# Altium schematic sheet FAN.SchDoc
size B
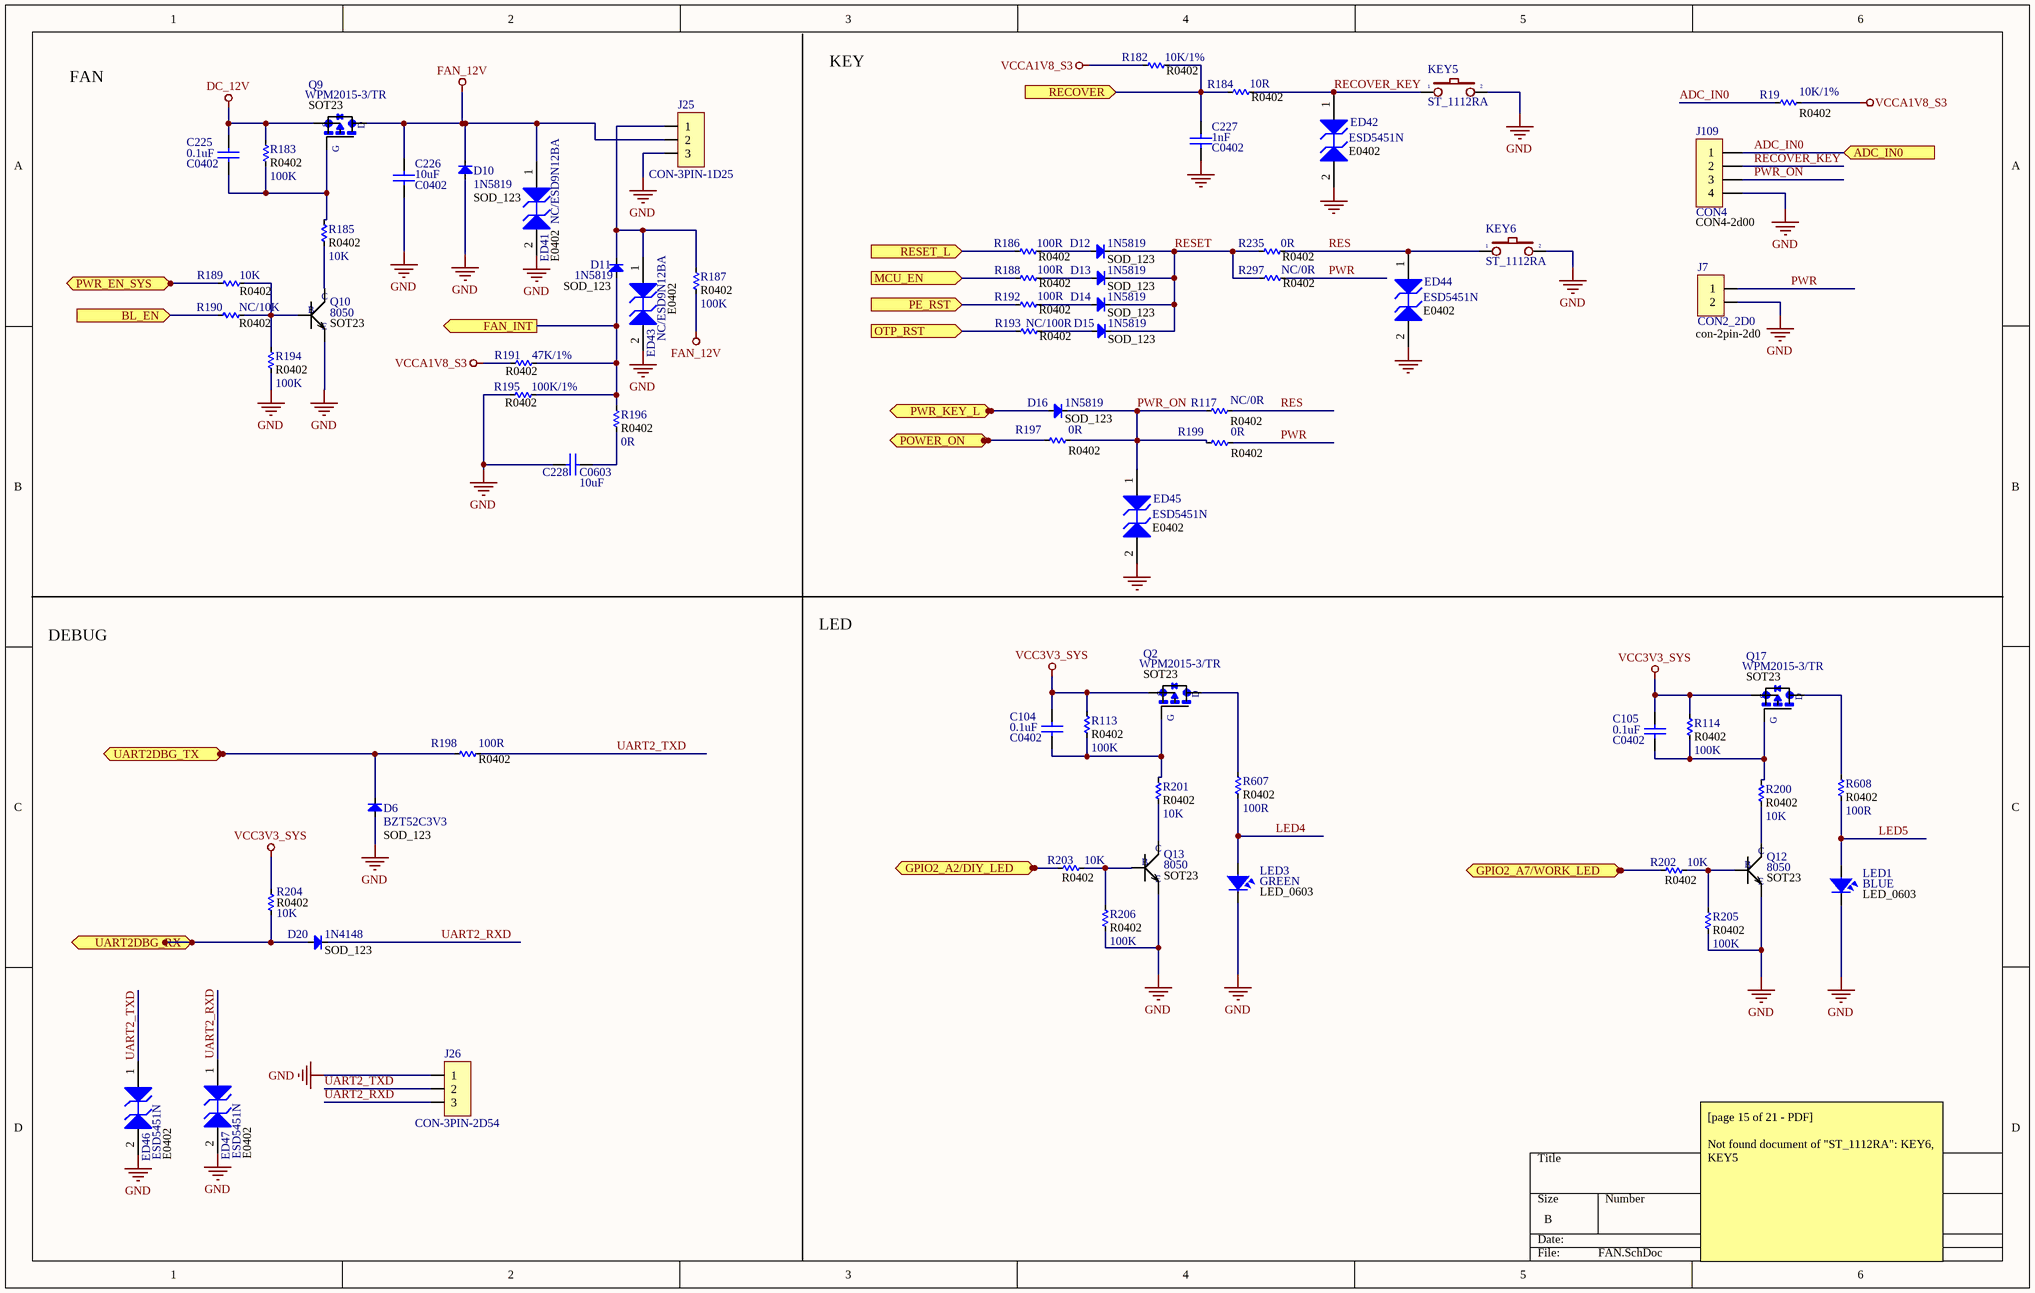
[diagram p0: FAN.SchDoc]

## Parts
C104  C0402  value 0.1uF  [C 0402]
C105  C0402  value 0.1uF  [C 0402]
C225  C0402  value 0.1uF  [C 0402]
C226  C0402  value 10uF  [C 0402]
C227  C0402  value 1nF  [C 0402]
C228  C0603  value 10uF  [C 0603]
D6  BZT52C3V3  typr: SOD_123  [DIO-SMD-123]
D10  value 1N5819  typr: SOD_123  [DIO-SMD-123]  (hidden comment: Diode SMD)
D11  value 1N5819  typr: SOD_123  [DIO-SMD-123]  (hidden comment: Diode SMD)
D12  value 1N5819  typr: SOD_123  [DIO-SMD-123]  (hidden comment: Diode SMD)
D13  value 1N5819  typr: SOD_123  [DIO-SMD-123]  (hidden comment: Diode SMD)
D14  value 1N5819  typr: SOD_123  [DIO-SMD-123]  (hidden comment: Diode SMD)
D15  value 1N5819  typr: SOD_123  [DIO-SMD-123]  (hidden comment: Diode SMD)
D16  value 1N5819  typr: SOD_123  [DIO-SMD-123]  (hidden comment: Diode SMD)
D20  value 1N4148  typr: SOD_123  [DIO-SMD-123]  (hidden comment: Diode SMD)
ED41  NC/ESD9N12BA  [DFN1006-2L]
ED42  ESD5451N  [DFN1006-2L]
ED43  NC/ESD9N12BA  [DFN1006-2L]
ED44  ESD5451N  [DFN1006-2L]
ED45  ESD5451N  [DFN1006-2L]
ED46  ESD5451N  [DFN1006-2L]
ED47  ESD5451N  [DFN1006-2L]
J7  CON2_2D0  [CON2]
J25  CON-3PIN-1D25  [CON3]
J26  CON-3PIN-2D54  [CON3]
J109  CON4  [CON4]
KEY5  ST_1112RA  [SW1-SMD]
KEY6  ST_1112RA  [SW1-SMD]
LED1  Package: LED_0603  Color: BLUE  [SM-LED-0805-Blue]  (hidden comment: LED SMD)
LED3  Package: LED_0603  Color: GREEN  [SM-LED-0805-Green]  (hidden comment: LED SMD)
Q2  WPM2015-3/TR  [*SSOT-3]
Q9  WPM2015-3/TR  [*SSOT-3]
Q10  8050  [*SOT-23]
Q12  8050  [*SOT-23]
Q13  8050  [*SOT-23]
Q17  WPM2015-3/TR  [*SSOT-3]
R19  R0402  value 10K/1%  [R 0402]
R113  R0402  value 100K  [R 0402]
R114  R0402  value 100K  [R 0402]
R117  R0402  value NC/0R  [R 0402]
R182  R0402  value 10K/1%  [R 0402]
R183  R0402  value 100K  [R 0402]
R184  R0402  value 10R  [R 0402]
R185  R0402  value 10K  [R 0402]
R186  R0402  value 100R  [R 0402]
R187  R0402  value 100K  [R 0402]
R188  R0402  value 100R  [R 0402]
R189  R0402  value 10K  [R 0402]
R190  R0402  value NC/10K  [R 0402]
R191  R0402  value 47K/1%  [R 0402]
R192  R0402  value 100R  [R 0402]
R193  R0402  value NC/100R  [R 0402]
R194  R0402  value 100K  [R 0402]
R195  R0402  value 100K/1%  [R 0402]
R196  R0402  value 0R  [R 0402]
R197  R0402  value 0R  [R 0402]
R198  R0402  value 100R  [R 0402]
R199  R0402  value 0R  [R 0402]
R200  R0402  value 10K  [R 0402]
R201  R0402  value 10K  [R 0402]
R202  R0402  value 10K  [R 0402]
R203  R0402  value 10K  [R 0402]
R204  R0402  value 10K  [R 0402]
R205  R0402  value 100K  [R 0402]
R206  R0402  value 100K  [R 0402]
R235  R0402  value 0R  [R 0402]
R297  R0402  value NC/0R  [R 0402]
R607  R0402  value 100R  [R 0402]
R608  R0402  value 100R  [R 0402]

## Ports
ADC_IN0 (in), BL_EN (in), FAN_INT (out), GPIO2_A2/DIY_LED (in), GPIO2_A7/WORK_LED (in), MCU_EN (in), OTP_RST (in), PE_RST (in), POWER_ON (in), PWR_EN_SYS (in), PWR_KEY_L (in), RECOVER (in), RESET_L (in), UART2DBG_RX (out), UART2DBG_TX (in)

## Nets
DC_12V: C225.1 Q9.2(S) R183.2
FAN_12V: C226.1 D10.2(K) ED41.1(A1) J25.2 Q9.3(D) R187.1
GND: C226.2 C227.2 C228.1 D6.1(A) D10.1(A) ED41.2(A2) ED42.2(A2) ED43.2(A2) ED44.2(A2) ED45.2(A2) ED46.2(A2) ED47.2(A2) J7.2 J25.3 J26.1 J109.4 KEY5.2 KEY6.2 LED1.2 LED3.2 Q10.2(E) Q12.2(E) Q13.2(E) R194.2 R195.2 R205.2 R206.2
VCC3V3_SYS: C104.1 C105.1 Q2.2(S) Q17.2(S) R113.1 R114.1 R204.1
VCCA1V8_S3: R19.2 R182.1 R191.2
ADC_IN0: J109.1 R19.1 ; port ADC_IN0
BL_EN: R190.2 ; port BL_EN
FAN_INT: D11.1(A) R191.1 R195.1 R196.1 ; port FAN_INT
GPIO2_A2/DIY_LED: R203.1 ; port GPIO2_A2/DIY_LED
GPIO2_A7/WORK_LED: R202.1 ; port GPIO2_A7/WORK_LED
LED4: LED3.1 R607.2
LED5: LED1.1 R608.2
MCU_EN: R188.1 ; port MCU_EN
OTP_RST: R193.1 ; port OTP_RST
PE_RST: R192.1 ; port PE_RST
POWER_ON: R197.1 ; port POWER_ON
PWR: J7.1 R199.2 R297.2
PWR_EN_SYS: R189.2 ; port PWR_EN_SYS
PWR_KEY_L: D16.1(A) ; port PWR_KEY_L
PWR_ON: D16.2(K) ED45.1(A1) J109.3 R117.1 R197.2 R199.1
RECOVER: C227.1 R182.2 R184.1 ; port RECOVER
RECOVER_KEY: ED42.1(A1) J109.2 KEY5.1 R184.2
RES: ED44.1(A1) KEY6.1 R117.2 R235.2
RESET: D12.2(K) D13.2(K) D14.2(K) D15.2(K) R235.1 R297.1
RESET_L: R186.1 ; port RESET_L
UART2_RXD: D20.2(K) ED47.1(A1) J26.3
UART2_TXD: ED46.1(A1) J26.2 R198.2
UART2DBG_RX: D20.1(A) R204.2 ; port UART2DBG_RX
UART2DBG_TX: D6.2(K) R198.1 ; port UART2DBG_TX
NetC104_2: C104.2 Q2.1(G) R113.2 R201.1
NetC105_2: C105.2 Q17.1(G) R114.2 R200.1
NetC225_2: C225.2 Q9.1(G) R183.1 R185.2
NetC228_2: C228.2 R196.2
NetD11_2: D11.2(K) ED43.1(A1) J25.1 R187.2
NetD12_1: D12.1(A) R186.2
NetD13_1: D13.1(A) R188.2
NetD14_1: D14.1(A) R192.2
NetD15_1: D15.1(A) R193.2
NetQ2_3: Q2.3(D) R607.1
NetQ10_1: Q10.1(B) R189.1 R190.1 R194.1
NetQ10_3: Q10.3(C) R185.1
NetQ12_1: Q12.1(B) R202.2 R205.1
NetQ12_3: Q12.3(C) R200.2
NetQ13_1: Q13.1(B) R203.2 R206.1
NetQ13_3: Q13.3(C) R201.2
NetQ17_3: Q17.3(D) R608.1

## Notes on the sheet
- FAN
- KEY
- LED
- DEBUG
- [page 15 of 21 - PDF]
  Not found document of "ST_1112RA": KEY6, KEY5
- (in symbol 1SMB54CAT3) E0402
- (in symbol FDN304P) SOT23
- (in symbol JP2) con-2pin-2d0
- (in symbol JP4x1-2.0) CON4-2d00
- (in symbol SMD-TRANSISTORS-NPN-25V-500MW(SOT-23)) SOT23

## Library data of the parts
C104 C105 C225-C228 = Cap: Capacitor; Published: 8-Jun-2000; LatestRevisionDate: 17-Jul-2002; LatestRevisionNote: Re-released for DXP Platform.; PackageReference: RAD-0.3; Publisher: Altium Limited; PackageDescription: Radial Cap, Thru-Hole; 2 Leads; 0.3 in Pin Spacing
D6 D10-D16 D20 = Diode SMD: Default Diode; Code - JEDEC: DO-214-AB; Published: 8-Jun-2000; Revision: July-2002: Re-released for DXP Platform.; Publisher: Altium Limited
  D6: Value: BZT52C3V3
ED41-ED47 = 1SMB54CAT3: 600 W Peak Power Zener Transient Voltage Suppressor, Bidirectional, 2-Pin SMB, Tape and Reel; Manufacturer: On Semiconductor; IR Max (uA): 5; PPK Max (W): 600; V(BR) Typ (V): 63.16; DatasheetVersion: Rev. A; PackageVersion: Rev. A, 01/2000; PackageReference: SMB-2-403C-01; PackageDescription: 2-Pin Small Molded Package, J-Bend Lead, Body 4.315 x 3.555 mm; Supplier 1: Digi-Key; Supplier Part Number 1: 1SMB54CAT3-ND; Direction: Bidirectional; Packing: Tape and Reel; Mounting Technology: Surface Mount; PartNumber: 1SMB54CAT3; ComponentLink1Description: Manufacturer URL; ComponentLink1URL: http://www.onsemi.com/; ComponentLink2Description: Datasheet; ComponentLink2URL: http://www.onsemi.com/pub_link/Collateral/1SMB10CAT3-D.PDF; ComponentLink3Description: Package Specification; ComponentLink3URL: http://www.onsemi.com/pub_link/Collateral/1SMB10CAT3-D.PDF
J7 = JP2: WR-PHD 2.54 mm Angled Socket Header; Manufacturer: W¨¹rth Elektronik eiSos GmbH; partNo: 613002143121; ComponentLink1 Description: Manufacturer; ComponentLink2 Description: Datasheet; NoPins: 02; Created Date: 29 March 2013; ComponentLink1URL: http://www.we-online.com; ComponentLink2URL: http://katalog.we-online.de/em/datasheet/6130xx143121.pdf; Created by: Karrer Zheng
J25 J26 = JP3: WR-PHD 2.54 mm Angled Socket Header; Manufacturer: W¨¹rth Elektronik eiSos GmbH; partNo: 613003143121; ComponentLink1 Description: Manufacturer; ComponentLink2 Description: Datasheet; NoPins: 03; Created Date: 29 March 2013; ComponentLink1URL: http://www.we-online.com; ComponentLink2URL: http://katalog.we-online.de/em/datasheet/6130xx143121.pdf; Created by: Karrer Zheng
J109 = JP4x1-2.0: WR-PHD 2.00 mm Socket Header; Manufacturer: W¨¹rth Elektronik eiSos GmbH; partNo: 62000411821; ComponentLink1 Description: Manufacturer; ComponentLink2 Description: Datasheet; NoPins: 04; Created Date: 2 April 2013; ComponentLink1URL: http://www.we-online.com; ComponentLink2URL: http://katalog.we-online.de/em/datasheet/6200xx11821.pdf; Created by: Karrer Zheng
KEY5 KEY6 = SW2: Switch button 2 pin; Value: SW chip 2 pin
LED1 LED3 = LED-SMD-0805
Q2 Q9 Q17 = FDN304P: P-Channel 20 V 52 mOhm 1.8V Surface Mount Specified PowerTrench Mosfet SSOT-3; MF: ON Semiconductor; Package: SC-59 ON Semiconductor; MP: FDN304P; Price: None; SnapEDA_Link: https://www.snapeda.com/parts/FDN304P/ON%20Semiconductor/view-part/?ref=snap; Availability: Unavailable; Value: *
Q10 Q12 Q13 = SMD-TRANSISTORS-NPN-25V-500MW(SOT-23): MF: Recom Power; MP: S8050; Package: SMD-8 Samsung; Price: None; SnapEDA_Link: https://www.snapeda.com/parts/S8050/Recom%20Power/view-part/?ref=snap; Availability: Unavailable; Value: *
R19 R113 R114 R117 R182-R206 R235 R297 R607 R608 = Res-SMD: Resistor; Manufacturer: Generic Components; Class: Passive; Published: 08/06/2000; Publisher: Altium Hobart Technology Centre